# Altium schematic sheet block_v8.SchDoc: mcHF QRP Transceiver
size A4; Author: Krassi A; CompanyName: M0NKA; Revision: 0.6.4; SheetTotal: 1
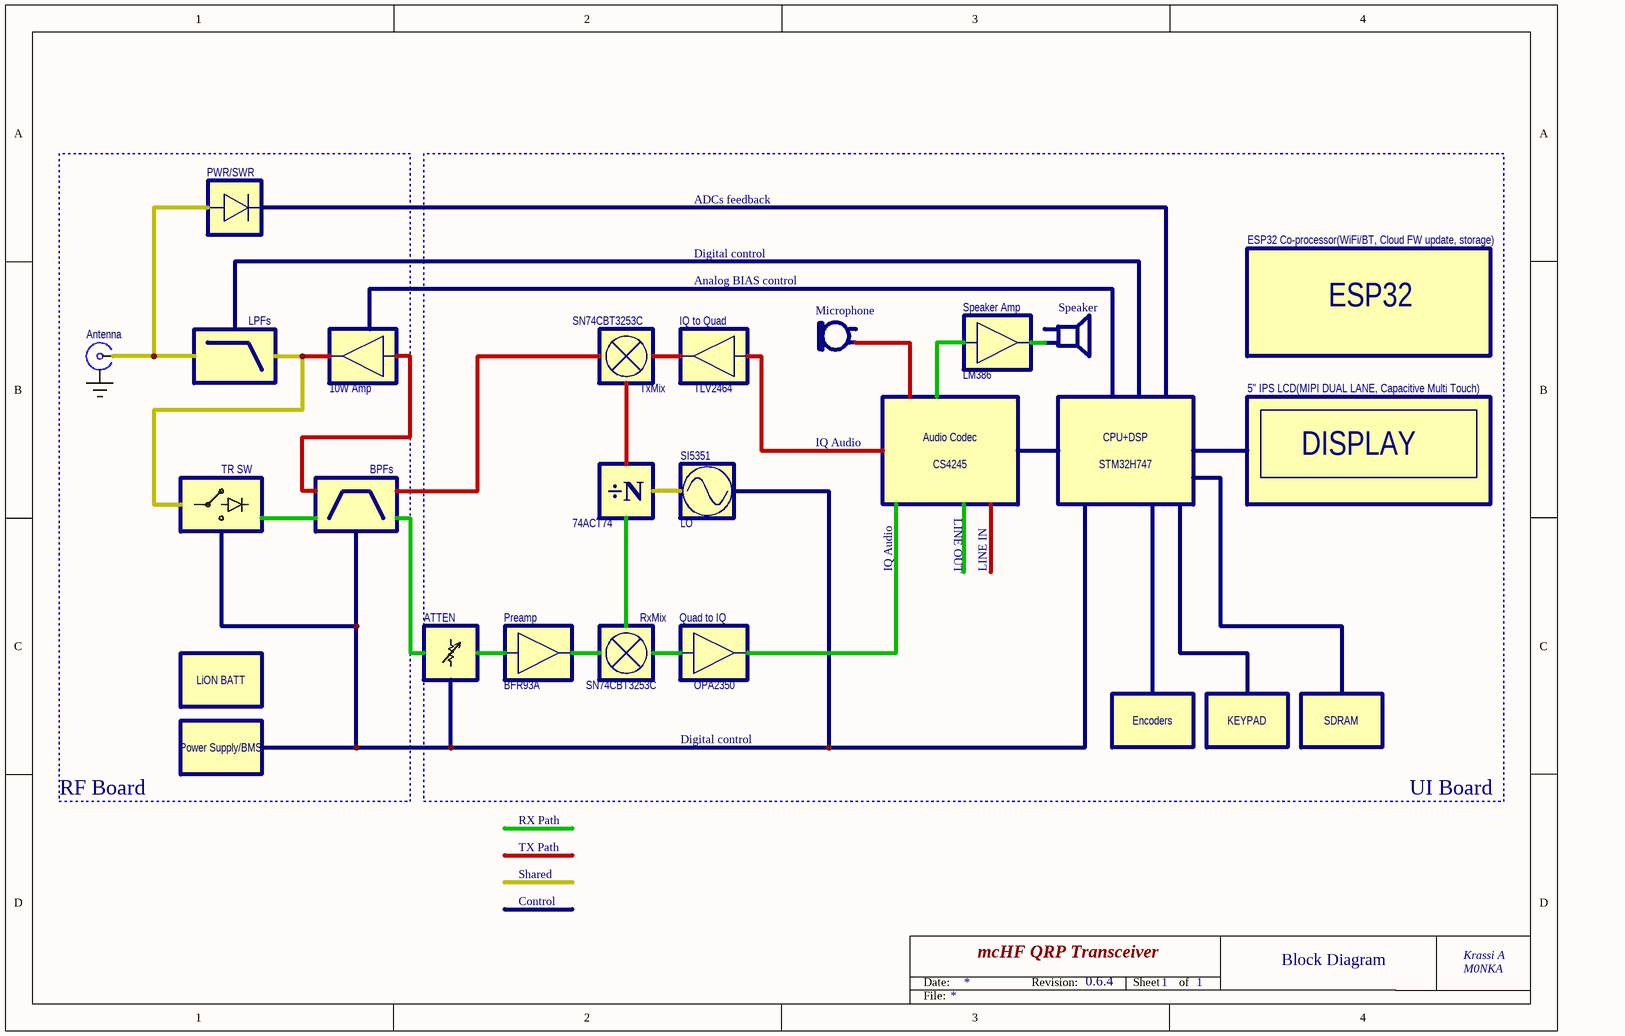
[diagram p0: block_v8.SchDoc]

## Parts
5"_IPS_LCD(MIPI_DUAL_LANE,_Capacitive_Multi_Touch)  DISPLAY  (value not drawn)
10W_Amp  AMP  (value not drawn)
Antenna  CON-RF  (value not drawn)
Audio_Codec  CS4245
bat  LiON BATT
BPFs  FILTER-BP  (value not drawn)
Encoders  BLK-SM  (value not drawn)
ESP32?  ESP32 Co-processor(WiFi/BT, Cloud FW update, storage)
IQ_to_Quad  TLV2464
KEYPAD  BLK-SM  (value not drawn)
LPFs  FILTER-LP  (value not drawn)
Microphone  Mic2  [PIN2]  (value not drawn)
Preamp  BFR93A
pwr  Power Supply/BMS
PWR/SWR  DET-POWER  (value not drawn)
Quad_to_IQ  OPA2350
R1  ATTEN
RxMix  SN74CBT3253C
SDRAM  BLK-SM  (value not drawn)
SI5351  LO
Speaker  Speaker  [PIN2]  (value not drawn)
Speaker_Amp  LM386
STM32H747  CPU+DSP
TR_SW  TR SW  (value not drawn)
Tx_Quad_Clk  74ACT74
TxMix  SN74CBT3253C

## Blocks framed on the sheet
RF Board: 10W_Amp Antenna bat BPFs LPFs pwr PWR/SWR TR_SW
UI Board: 5"_IPS_LCD(MIPI_DUAL_LANE,_Capacitive_Multi_Touch) Audio_Codec Encoders ESP32? IQ_to_Quad KEYPAD Microphone Preamp Quad_to_IQ R1 RxMix SDRAM SI5351 Speaker Speaker_Amp STM32H747 Tx_Quad_Clk TxMix

## Notes on the sheet
- ADCs feedback
- Digital control
- Analog BIAS control
- IQ Audio
- LINE OUT
- LINE IN
- RX Path
- TX Path
- Control
- Shared
- 1
- Block Diagram
- Date:
- Revision:
- Sheet
- of
- File:
- (in symbol DIVIDER) ÷N

## Library data of the parts
Audio_Codec STM32H747 = BLK-LG
bat pwr = BLK-SM
ESP32? = ESP32
IQ_to_Quad Preamp Quad_to_IQ Speaker_Amp = AMP
Microphone = Mic2: Microphone; Published: 24-Mar-1999; LatestRevisionDate: 17-Jul-2002; LatestRevisionNote: Re-released for DXP Platform.; PackageReference: PIN2; Publisher: Altium Limited
R1 = ATTEN-VAR
RxMix TxMix = MIXER
SI5351 = VCO
Speaker = Speaker: Loudspeaker; Published: 24-Mar-1999; LatestRevisionDate: 17-Jul-2002; LatestRevisionNote: Re-released for DXP Platform.; PackageReference: PIN2; Publisher: Altium Limited
Tx_Quad_Clk = DIVIDER